# Altium schematic sheet Matrix.SchDoc
size B
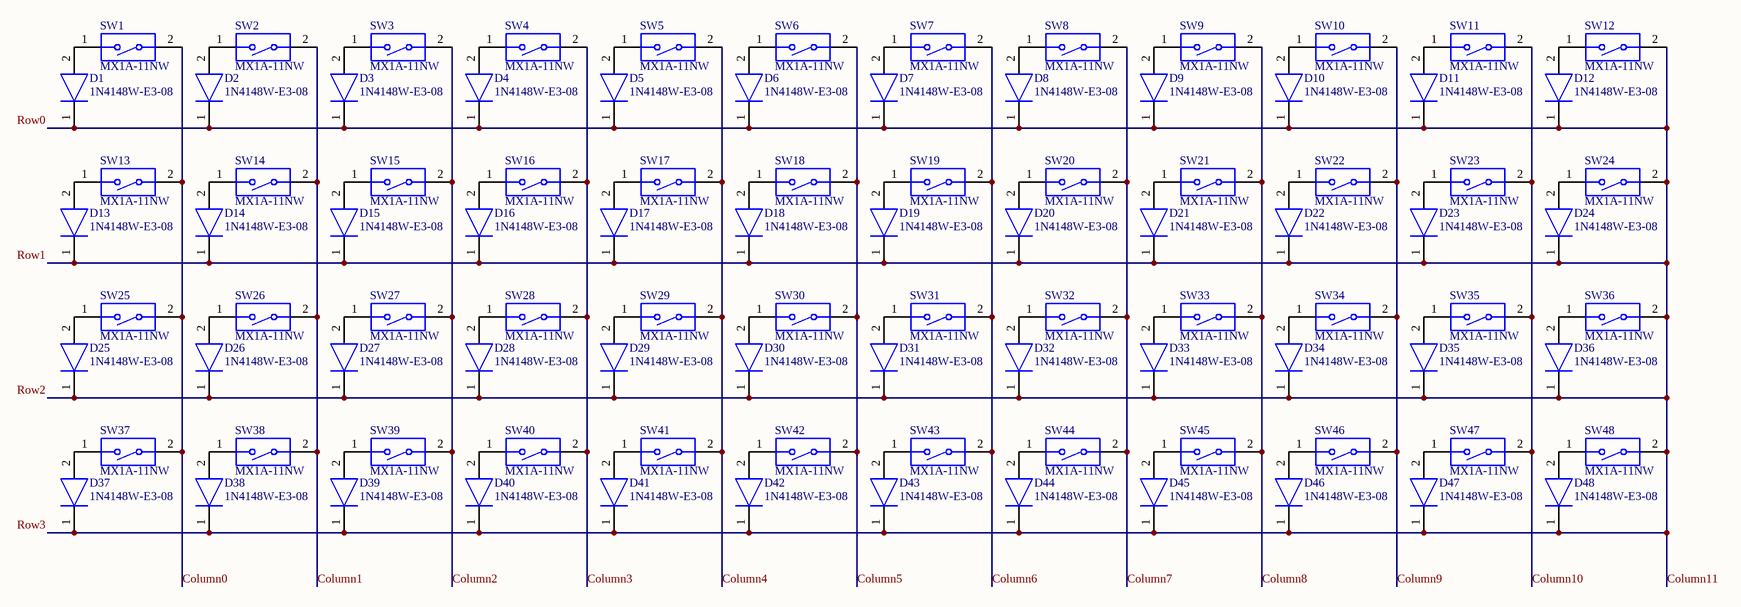
[diagram p0: Matrix.SchDoc]

## Parts
D1  1N4148W-E3-08  [SOD3716X135N]
D2  1N4148W-E3-08  [SOD3716X135N]
D3  1N4148W-E3-08  [SOD3716X135N]
D4  1N4148W-E3-08  [SOD3716X135N]
D5  1N4148W-E3-08  [SOD3716X135N]
D6  1N4148W-E3-08  [SOD3716X135N]
D7  1N4148W-E3-08  [SOD3716X135N]
D8  1N4148W-E3-08  [SOD3716X135N]
D9  1N4148W-E3-08  [SOD3716X135N]
D10  1N4148W-E3-08  [SOD3716X135N]
D11  1N4148W-E3-08  [SOD3716X135N]
D12  1N4148W-E3-08  [SOD3716X135N]
D13  1N4148W-E3-08  [SOD3716X135N]
D14  1N4148W-E3-08  [SOD3716X135N]
D15  1N4148W-E3-08  [SOD3716X135N]
D16  1N4148W-E3-08  [SOD3716X135N]
D17  1N4148W-E3-08  [SOD3716X135N]
D18  1N4148W-E3-08  [SOD3716X135N]
D19  1N4148W-E3-08  [SOD3716X135N]
D20  1N4148W-E3-08  [SOD3716X135N]
D21  1N4148W-E3-08  [SOD3716X135N]
D22  1N4148W-E3-08  [SOD3716X135N]
D23  1N4148W-E3-08  [SOD3716X135N]
D24  1N4148W-E3-08  [SOD3716X135N]
D25  1N4148W-E3-08  [SOD3716X135N]
D26  1N4148W-E3-08  [SOD3716X135N]
D27  1N4148W-E3-08  [SOD3716X135N]
D28  1N4148W-E3-08  [SOD3716X135N]
D29  1N4148W-E3-08  [SOD3716X135N]
D30  1N4148W-E3-08  [SOD3716X135N]
D31  1N4148W-E3-08  [SOD3716X135N]
D32  1N4148W-E3-08  [SOD3716X135N]
D33  1N4148W-E3-08  [SOD3716X135N]
D34  1N4148W-E3-08  [SOD3716X135N]
D35  1N4148W-E3-08  [SOD3716X135N]
D36  1N4148W-E3-08  [SOD3716X135N]
D37  1N4148W-E3-08  [SOD3716X135N]
D38  1N4148W-E3-08  [SOD3716X135N]
D39  1N4148W-E3-08  [SOD3716X135N]
D40  1N4148W-E3-08  [SOD3716X135N]
D41  1N4148W-E3-08  [SOD3716X135N]
D42  1N4148W-E3-08  [SOD3716X135N]
D43  1N4148W-E3-08  [SOD3716X135N]
D44  1N4148W-E3-08  [SOD3716X135N]
D45  1N4148W-E3-08  [SOD3716X135N]
D46  1N4148W-E3-08  [SOD3716X135N]
D47  1N4148W-E3-08  [SOD3716X135N]
D48  1N4148W-E3-08  [SOD3716X135N]
SW1  MX1A-11NW  [CHRY-MX1A-11NW_V]
SW2  MX1A-11NW  [CHRY-MX1A-11NW_V]
SW3  MX1A-11NW  [CHRY-MX1A-11NW_V]
SW4  MX1A-11NW  [CHRY-MX1A-11NW_V]
SW5  MX1A-11NW  [CHRY-MX1A-11NW_V]
SW6  MX1A-11NW  [CHRY-MX1A-11NW_V]
SW7  MX1A-11NW  [CHRY-MX1A-11NW_V]
SW8  MX1A-11NW  [CHRY-MX1A-11NW_V]
SW9  MX1A-11NW  [CHRY-MX1A-11NW_V]
SW10  MX1A-11NW  [CHRY-MX1A-11NW_V]
SW11  MX1A-11NW  [CHRY-MX1A-11NW_V]
SW12  MX1A-11NW  [CHRY-MX1A-11NW_V]
SW13  MX1A-11NW  [CHRY-MX1A-11NW_V]
SW14  MX1A-11NW  [CHRY-MX1A-11NW_V]
SW15  MX1A-11NW  [CHRY-MX1A-11NW_V]
SW16  MX1A-11NW  [CHRY-MX1A-11NW_V]
SW17  MX1A-11NW  [CHRY-MX1A-11NW_V]
SW18  MX1A-11NW  [CHRY-MX1A-11NW_V]
SW19  MX1A-11NW  [CHRY-MX1A-11NW_V]
SW20  MX1A-11NW  [CHRY-MX1A-11NW_V]
SW21  MX1A-11NW  [CHRY-MX1A-11NW_V]
SW22  MX1A-11NW  [CHRY-MX1A-11NW_V]
SW23  MX1A-11NW  [CHRY-MX1A-11NW_V]
SW24  MX1A-11NW  [CHRY-MX1A-11NW_V]
SW25  MX1A-11NW  [CHRY-MX1A-11NW_V]
SW26  MX1A-11NW  [CHRY-MX1A-11NW_V]
SW27  MX1A-11NW  [CHRY-MX1A-11NW_V]
SW28  MX1A-11NW  [CHRY-MX1A-11NW_V]
SW29  MX1A-11NW  [CHRY-MX1A-11NW_V]
SW30  MX1A-11NW  [CHRY-MX1A-11NW_V]
SW31  MX1A-11NW  [CHRY-MX1A-11NW_V]
SW32  MX1A-11NW  [CHRY-MX1A-11NW_V]
SW33  MX1A-11NW  [CHRY-MX1A-11NW_V]
SW34  MX1A-11NW  [CHRY-MX1A-11NW_V]
SW35  MX1A-11NW  [CHRY-MX1A-11NW_V]
SW36  MX1A-11NW  [CHRY-MX1A-11NW_V]
SW37  MX1A-11NW  [CHRY-MX1A-11NW_V]
SW38  MX1A-11NW  [CHRY-MX1A-11NW_V]
SW39  MX1A-11NW  [CHRY-MX1A-11NW_V]
SW40  MX1A-11NW  [CHRY-MX1A-11NW_V]
SW41  MX1A-11NW  [CHRY-MX1A-11NW_V]
SW42  MX1A-11NW  [CHRY-MX1A-11NW_V]
SW43  MX1A-11NW  [CHRY-MX1A-11NW_V]
SW44  MX1A-11NW  [CHRY-MX1A-11NW_V]
SW45  MX1A-11NW  [CHRY-MX1A-11NW_V]
SW46  MX1A-11NW  [CHRY-MX1A-11NW_V]
SW47  MX1A-11NW  [CHRY-MX1A-11NW_V]
SW48  MX1A-11NW  [CHRY-MX1A-11NW_V]

## Nets
Column0: SW1.2 SW13.2 SW25.2 SW37.2
Column1: SW2.2 SW14.2 SW26.2 SW38.2
Column2: SW3.2 SW15.2 SW27.2 SW39.2
Column3: SW4.2 SW16.2 SW28.2 SW40.2
Column4: SW5.2 SW17.2 SW29.2 SW41.2
Column5: SW6.2 SW18.2 SW30.2 SW42.2
Column6: SW7.2 SW19.2 SW31.2 SW43.2
Column7: SW8.2 SW20.2 SW32.2 SW44.2
Column8: SW9.2 SW21.2 SW33.2 SW45.2
Column9: SW10.2 SW22.2 SW34.2 SW46.2
Column10: SW11.2 SW23.2 SW35.2 SW47.2
Column11: D1.1(K) D2.1(K) D3.1(K) D4.1(K) D5.1(K) D6.1(K) D7.1(K) D8.1(K) D9.1(K) D10.1(K) D11.1(K) D12.1(K) D13.1(K) D14.1(K) D15.1(K) D16.1(K) D17.1(K) D18.1(K) D19.1(K) D20.1(K) D21.1(K) D22.1(K) D23.1(K) D24.1(K) D25.1(K) D26.1(K) D27.1(K) D28.1(K) D29.1(K) D30.1(K) D31.1(K) D32.1(K) D33.1(K) D34.1(K) D35.1(K) D36.1(K) D37.1(K) D38.1(K) D39.1(K) D40.1(K) D41.1(K) D42.1(K) D43.1(K) D44.1(K) D45.1(K) D46.1(K) D47.1(K) D48.1(K) SW12.2 SW24.2 SW36.2 SW48.2  [also labelled Row0, Row1, Row2, Row3]
NetD1_2: D1.2(A) SW1.1
NetD2_2: D2.2(A) SW2.1
NetD3_2: D3.2(A) SW3.1
NetD4_2: D4.2(A) SW4.1
NetD5_2: D5.2(A) SW5.1
NetD6_2: D6.2(A) SW6.1
NetD7_2: D7.2(A) SW7.1
NetD8_2: D8.2(A) SW8.1
NetD9_2: D9.2(A) SW9.1
NetD10_2: D10.2(A) SW10.1
NetD11_2: D11.2(A) SW11.1
NetD12_2: D12.2(A) SW12.1
NetD13_2: D13.2(A) SW13.1
NetD14_2: D14.2(A) SW14.1
NetD15_2: D15.2(A) SW15.1
NetD16_2: D16.2(A) SW16.1
NetD17_2: D17.2(A) SW17.1
NetD18_2: D18.2(A) SW18.1
NetD19_2: D19.2(A) SW19.1
NetD20_2: D20.2(A) SW20.1
NetD21_2: D21.2(A) SW21.1
NetD22_2: D22.2(A) SW22.1
NetD23_2: D23.2(A) SW23.1
NetD24_2: D24.2(A) SW24.1
NetD25_2: D25.2(A) SW25.1
NetD26_2: D26.2(A) SW26.1
NetD27_2: D27.2(A) SW27.1
NetD28_2: D28.2(A) SW28.1
NetD29_2: D29.2(A) SW29.1
NetD30_2: D30.2(A) SW30.1
NetD31_2: D31.2(A) SW31.1
NetD32_2: D32.2(A) SW32.1
NetD33_2: D33.2(A) SW33.1
NetD34_2: D34.2(A) SW34.1
NetD35_2: D35.2(A) SW35.1
NetD36_2: D36.2(A) SW36.1
NetD37_2: D37.2(A) SW37.1
NetD38_2: D38.2(A) SW38.1
NetD39_2: D39.2(A) SW39.1
NetD40_2: D40.2(A) SW40.1
NetD41_2: D41.2(A) SW41.1
NetD42_2: D42.2(A) SW42.1
NetD43_2: D43.2(A) SW43.1
NetD44_2: D44.2(A) SW44.1
NetD45_2: D45.2(A) SW45.1
NetD46_2: D46.2(A) SW46.1
NetD47_2: D47.2(A) SW47.1
NetD48_2: D48.2(A) SW48.1

## Library data of the parts
D1-D48 = 1N4148W-E3-08: Diode; Manufacturer_Name: Vishay; Datasheet Link: http://www.vishay.com/docs/85748/1n4148w.pdf; Height: 1.35mm; Manufacturer_Part_Number: 1N4148W-E3-08; Arrow Part Number: 1N4148W-E3-08; Arrow Price/Stock: https://www.arrow.com/en/products/1n4148w-e3-08/vishay; Mouser Part Number: 78-1N4148W-E3-08; Mouser Price/Stock: https://www.mouser.co.uk/ProductDetail/Vishay-Semiconductors/1N4148W-E3-08?qs=bTzheeSci6TVjpxfjjRVMw%3D%3D
SW1-SW48 = CMP-2000-06786-1: Keylock Switch, 12 V, -10 to 70 degC, 2-Pin THD, RoHS, Bulk; Manufacturer: Cherry; Part No: MX1A11NW; Maximum DC Voltage Rating: 12V; COO: UK; Row Spacing: 6.35mm; Pole Throw Configuration: SPST; Total Travel: 4.06mm; Illumination Type: N/R; Actuator Style: Button; Operating Force: 0.58N; Electrical Life: 50000000Cycle; Minimum Insulation Resistance: 100MOhm; Body Orientation: Straight; Actuator Length: 3.6mm; Switch Configuration: N.O.; Maximum Current Rating: 0.01A; Maximum Contact Resistance: 200mOhm; Actuator Color: N/A; Terminal Type: PCPins; Operating Temperature: -10to70C; Number of Terminals: 2; Operating Speed: N/A; Maximum AC Voltage Rating: 12V; Housing Material: N/A; Datasheet URL: https://cdn.sparkfun.com/datasheets/Components/Switches/MX%20Series.pdf; Type: DesktopProfile; Terminal Pitch: 2.54mm; Package Reference: MX1A-11NW; ECCN: EAR99; Family: MX; Packaging: N/A; HTS: 8536509065; Actuator Material: N/A; Package Description: 2-Pin Through Hole Device, Body 15.6 x 15.6 mm; Dielectric Strength: N/A; Illumination Color: N/R; Manufacturer URL: http://cherryswitches.com/cn/; Dimension: 15.6x15.6x15.2mm; Mechanical Life: N/A; RoHS: Unknown; Contact Plating: N/A; Supplier: CherryElectrical; Contact Material: Silver/Gold; IP Rating: N/A; Mounting: ThroughHole; Datasheet Version: 09/2000; Maximum Power Rating: N/A; Mounting Technology: ThroughHole